# Altium schematic sheet Sheet.schdoc
size 366 x 220 mm
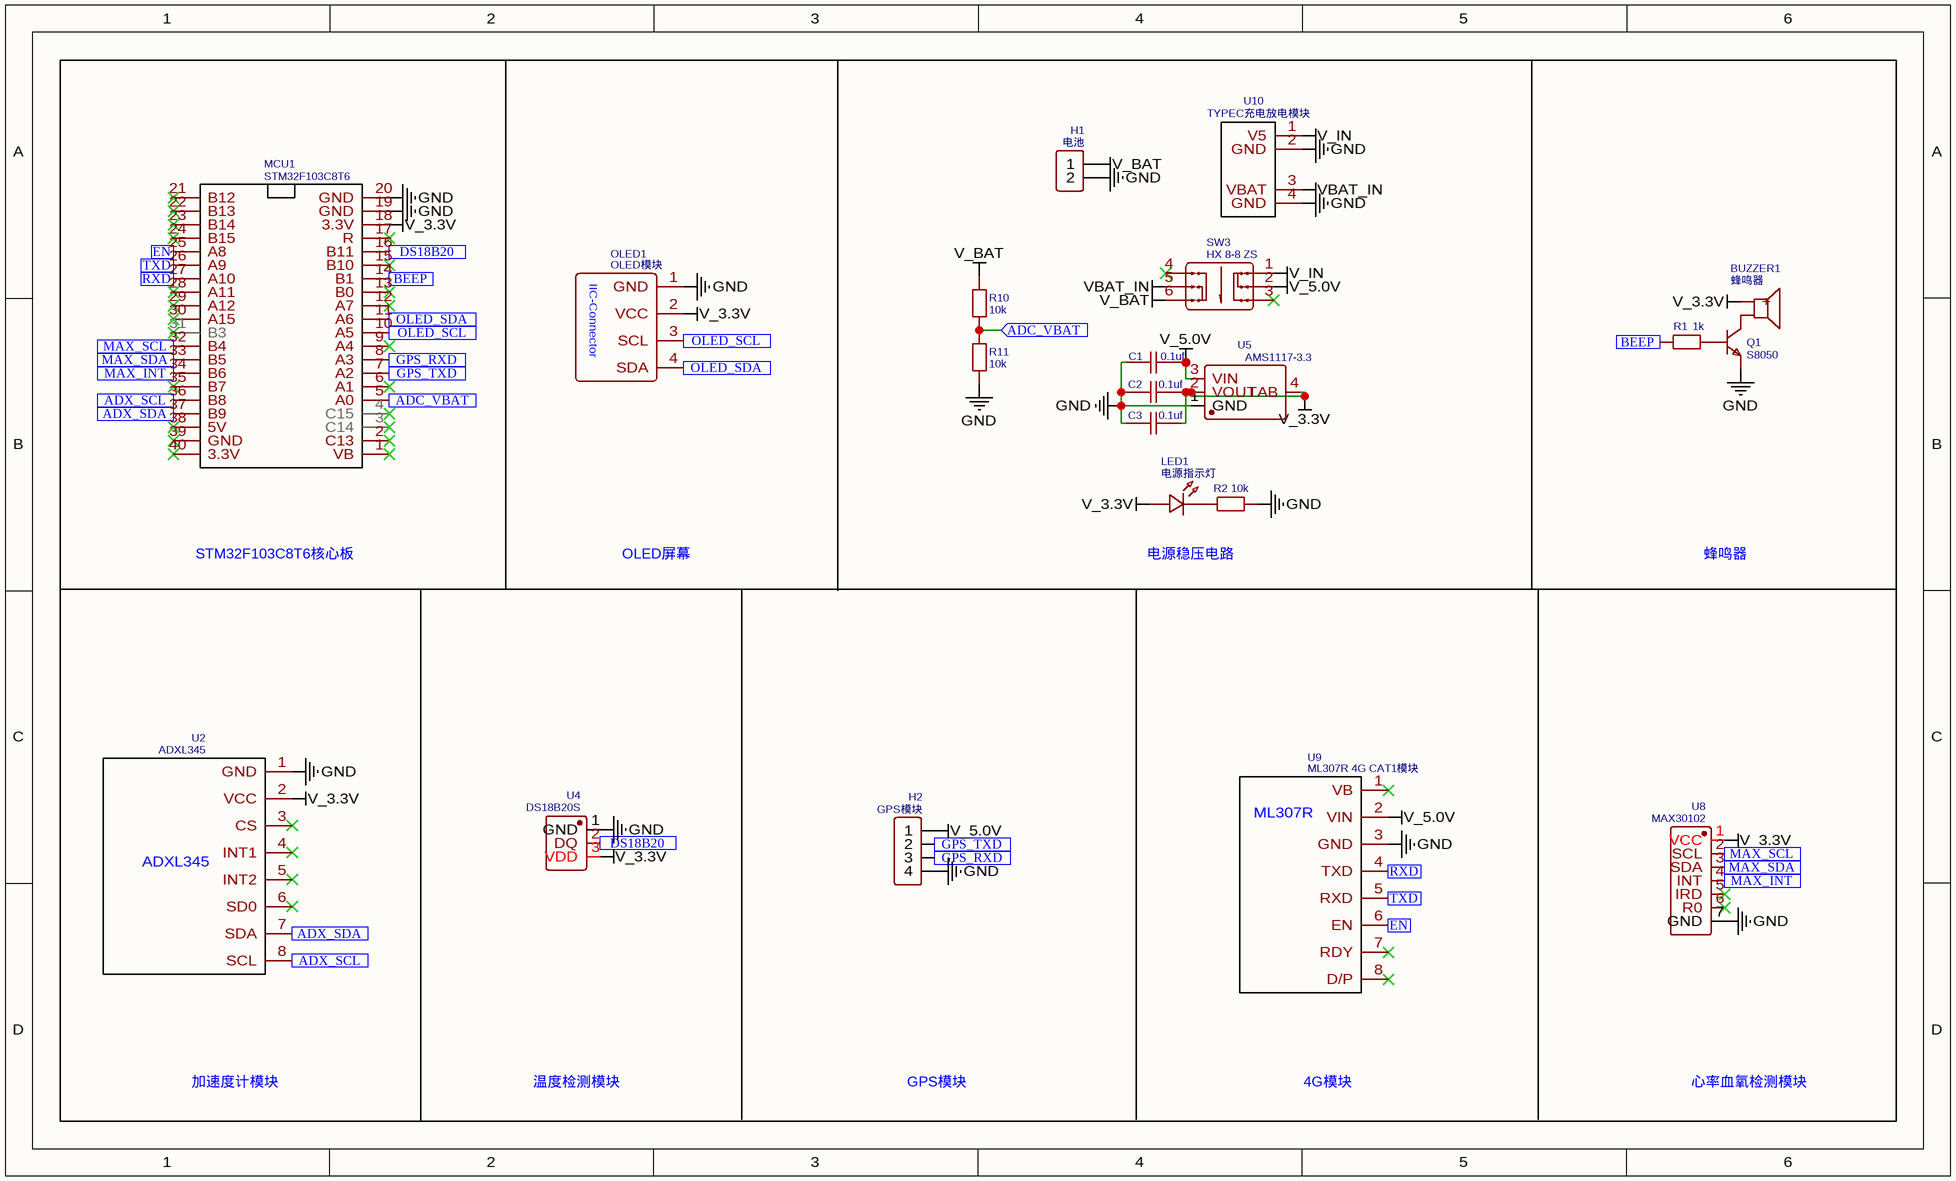
[diagram p0: Sheet.schdoc]

## Parts
BUZZER1  蜂鸣器  [BUZ-TH_BD12.0-P7.60-D0.6-FD]
C1  0.1uf  [C0805]
C2  0.1uf  [C0805]
C3  0.1uf  [C0805]
H1  电池  [HDR-F-2.54_1X2]
H2  GPS模块  [HDR-F-2.54_1X4]
LED1  电源指示灯  [LED0603_RED]
MCU1  STM32F103C8T6  [STM32F103C8T6_BLUE]
OLED1  OLED模块  [0.96OLED_4P]
Q1  S8050  [SOT-23-3_L2.9-W1.3-P1.90-LS2.4-BR]
R1  1k  [R0603]
R2  10k  [R0603]
R10  10k  [R0603]
R11  10k  [R0603]
SW3  HX 8-8 ZS  [SW-TH_6P-L8.0-W8.0-P2.50-TL]
U2  ADXL345  [ADXL345]
U4  DS18B20S  [TO-92-3_L4.9-W3.7-P1.27-L]
U5  AMS1117-3.3  [SOT-223-3_L6.5-W3.5-P3.05-LS7.0]
U8  MAX30102  [MAX30100]
U9  ML307R 4G CAT1模块  [ML307R]
U10  TYPEC充电放电模块  [TYPEC充放电模块]

## Ports
ADC_VBAT (in), ADX_SCL (in), ADX_SDA (in), BEEP (in), DS18B20 (in), EN (in), GPS_RXD (in), GPS_TXD (in), MAX_INT (in), MAX_SCL (in), MAX_SDA (in), OLED_SCL (in), OLED_SDA (in), RXD (in), TXD (in)

## Nets
GND: C1.1 C2.1 C3.1 H1.2 H2.4 MCU1.19(GND) MCU1.20(GND) OLED1.1(GND) Q1.2(E) R2.2 R11.1 U2.1(GND) U4.1(GND) U5.1(GND) U8.7(GND) U9.3(GND) U10.2(GND) U10.4(GND)
V_3.3V: BUZZER1.1(+) C2.2 C3.2 LED1.1 MCU1.18(3.3V) OLED1.2(VCC) U2.2(VCC) U4.3(VDD) U5.2(VOUT) U5.4(TAB) U8.1(VCC)
V_5.0V: C1.2 H2.1 SW3.2 U5.3(VIN) U9.2(VIN)
V_BAT: H1.1 R10.2 SW3.6
V_IN: SW3.1 U10.1(V5)
VBAT_IN: SW3.5 U10.3(VBAT)
ADC_VBAT: MCU1.5(A0) R10.1 R11.2 ; port ADC_VBAT
ADX_SCL: MCU1.36(B8) U2.8(SCL) ; port ADX_SCL
ADX_SDA: MCU1.37(B9) U2.7(SDA) ; port ADX_SDA
BEEP: MCU1.14(B1) R1.1 ; port BEEP
DS18B20: MCU1.16(B11) U4.2(DQ) ; port DS18B20
EN: MCU1.25(A8) U9.6(EN) ; port EN
GPS_RXD: H2.3 MCU1.8(A3) ; port GPS_RXD
GPS_TXD: H2.2 MCU1.7(A2) ; port GPS_TXD
MAX_INT: MCU1.34(B6) U8.4(INT) ; port MAX_INT
MAX_SCL: MCU1.32(B4) U8.2(SCL) ; port MAX_SCL
MAX_SDA: MCU1.33(B5) U8.3(SDA) ; port MAX_SDA
OLED_SCL: MCU1.10(A5) OLED1.3(SCL) ; port OLED_SCL
OLED_SDA: MCU1.11(A6) OLED1.4(SDA) ; port OLED_SDA
RXD: MCU1.27(A10) U9.4(TXD) ; port RXD
TXD: MCU1.26(A9) U9.5(RXD) ; port TXD
NetBUZZER1_2: BUZZER1.2 Q1.3(C)
NetLED1_2: LED1.2 R2.1
NetQ1_1: Q1.1(B) R1.2

Not connected (* = marked no-connect by the designer): MCU1 1(VB)* 2(C13)* 3(C14)* 4(C15)* 6(A1)* 9(A4)* 12(A7)* 13(B0)* 15(B10)* 17(R)* 21(B12)* 22(B13)* 23(B14)* 24(B15)* 28(A11)* 29(A12)* 30(A15)* 31(B3)* 35(B7)* 38(5V)* 39(GND)* 40(3.3V)*; SW3 3* 4*; U2 3(CS)* 4(INT1)* 5(INT2)* 6(SD0)*; U8 5(IRD)* 6(R0)*; U9 1(VB)* 7(RDY)* 8(D/P)*

## Notes on the sheet
- STM32F103C8T6核心板
- OLED屏幕
- 电源稳压电路
- 蜂鸣器
- 加速度计模块
- 温度检测模块
- GPS模块
- 4G模块
- 心率血氧检测模块
- (in symbol ML307R 4G CAT1模块) ML307R
- (in symbol OLED模块) IIC-Connector

## Library data of the parts
BUZZER1 = 蜂鸣器: Manufacturer: 华能; Manufacturer Part: TMB12A05; nameAlias: Value; Supplier: LCSC; Supplier Part: C96093; spicePre: B; spiceSymbolName: TMB12A05
C1-C3 = 0.1uf: nameAlias: Value(F); Contributor: LCEDA_Lib; spicePre: C; spiceSymbolName: C_0805_US
H1 = 电池: Contributor: LCEDA_Lib; Supplier Part: C49661; Supplier: LCSC; spicePre: H; spiceSymbolName: HDR-F-2.54_1x2
H2 = GPS模块: Contributor: LCEDA_Lib; Supplier Part: C225501; Supplier: LCSC; spicePre: H; spiceSymbolName: HDR-F-2.54_1x4
LED1 = 电源指示灯: Manufacturer: EVERLIGHT(台湾亿光); Manufacturer Part: 19-217/R6C-AL1M2VY/3T; Contributor: LCEDA_01; Supplier Part: C72044; Supplier: LCSC; spicePre: L; spiceSymbolName: LED-0603_R
MCU1 = STM32F103C8T6: Contributor: smileforu; spicePre: M; spiceSymbolName: STM32F103C8T6_BLUE
OLED1 = OLED模块: Manufacturer: null; Manufacturer Part: 0.96OLED_4P_MODULE_JX; Contributor: LCSC; Supplier: LCSC; Supplier Part: C9900004566; JLCPCB Part Class: Extended Part; spicePre: O; spiceSymbolName: 0.96OLED_4P
Q1 = S8050: Manufacturer: YONGYUTAI(永裕泰); Contributor: LCSC; Supplier: LCSC; Supplier Part: C2891804; Manufacturer Part: S8050; JLCPCB Part Class: Extended Part; spicePre: Q; spiceSymbolName: S8050_C2891804
R1 = 1k: nameAlias: Value(Ω); Contributor: LCEDA_Lib; spicePre: R; spiceSymbolName: R_0603_EU
R2 R10 R11 = 10k: nameAlias: Value(Ω); Contributor: LCEDA_Lib; spicePre: R; spiceSymbolName: R_0603_EU
SW3 = HX 8-8 ZS: Manufacturer: hanxia(韩下); Contributor: lcsc; Supplier: LCSC; Supplier Part: C7435563; Manufacturer Part: HX 8-8 ZS; spicePre: S; spiceSymbolName: HX 8-8 ZS
U2 = ADXL345: Contributor: cyr1; spicePre: U; spiceSymbolName: ADXL345
U4 = DS18B20S: Manufacturer: Mysentech(敏源传感); Contributor: lcsc; Supplier: LCSC; Supplier Part: C41361412; Manufacturer Part: DS18B20S; spicePre: U; spiceSymbolName: DS18B20S
U5 = AMS1117-3.3: Manufacturer: TWGMC(台湾迪嘉); Contributor: lcsc; Supplier: LCSC; Supplier Part: C5250992; Manufacturer Part: AMS1117-3.3; JLCPCB Part Class: Extended Part; spicePre: U; spiceSymbolName: AMS1117-3.3_C5250992
U8 = MAX30102: Contributor: cy12138; spicePre: U; spiceSymbolName: MAX30100
U9 = ML307R 4G CAT1模块: Contributor: vane; spicePre: U; spiceSymbolName: ML307R 4G CAT1模块
U10 = TYPEC充电放电模块: Contributor: lty1412; spicePre: U; spiceSymbolName: TYPEC充电放电模块